# Altium schematic sheet Connectors.SchDoc
size 420 x 297 mm; SheetNumber: 3; SheetTotal: 5
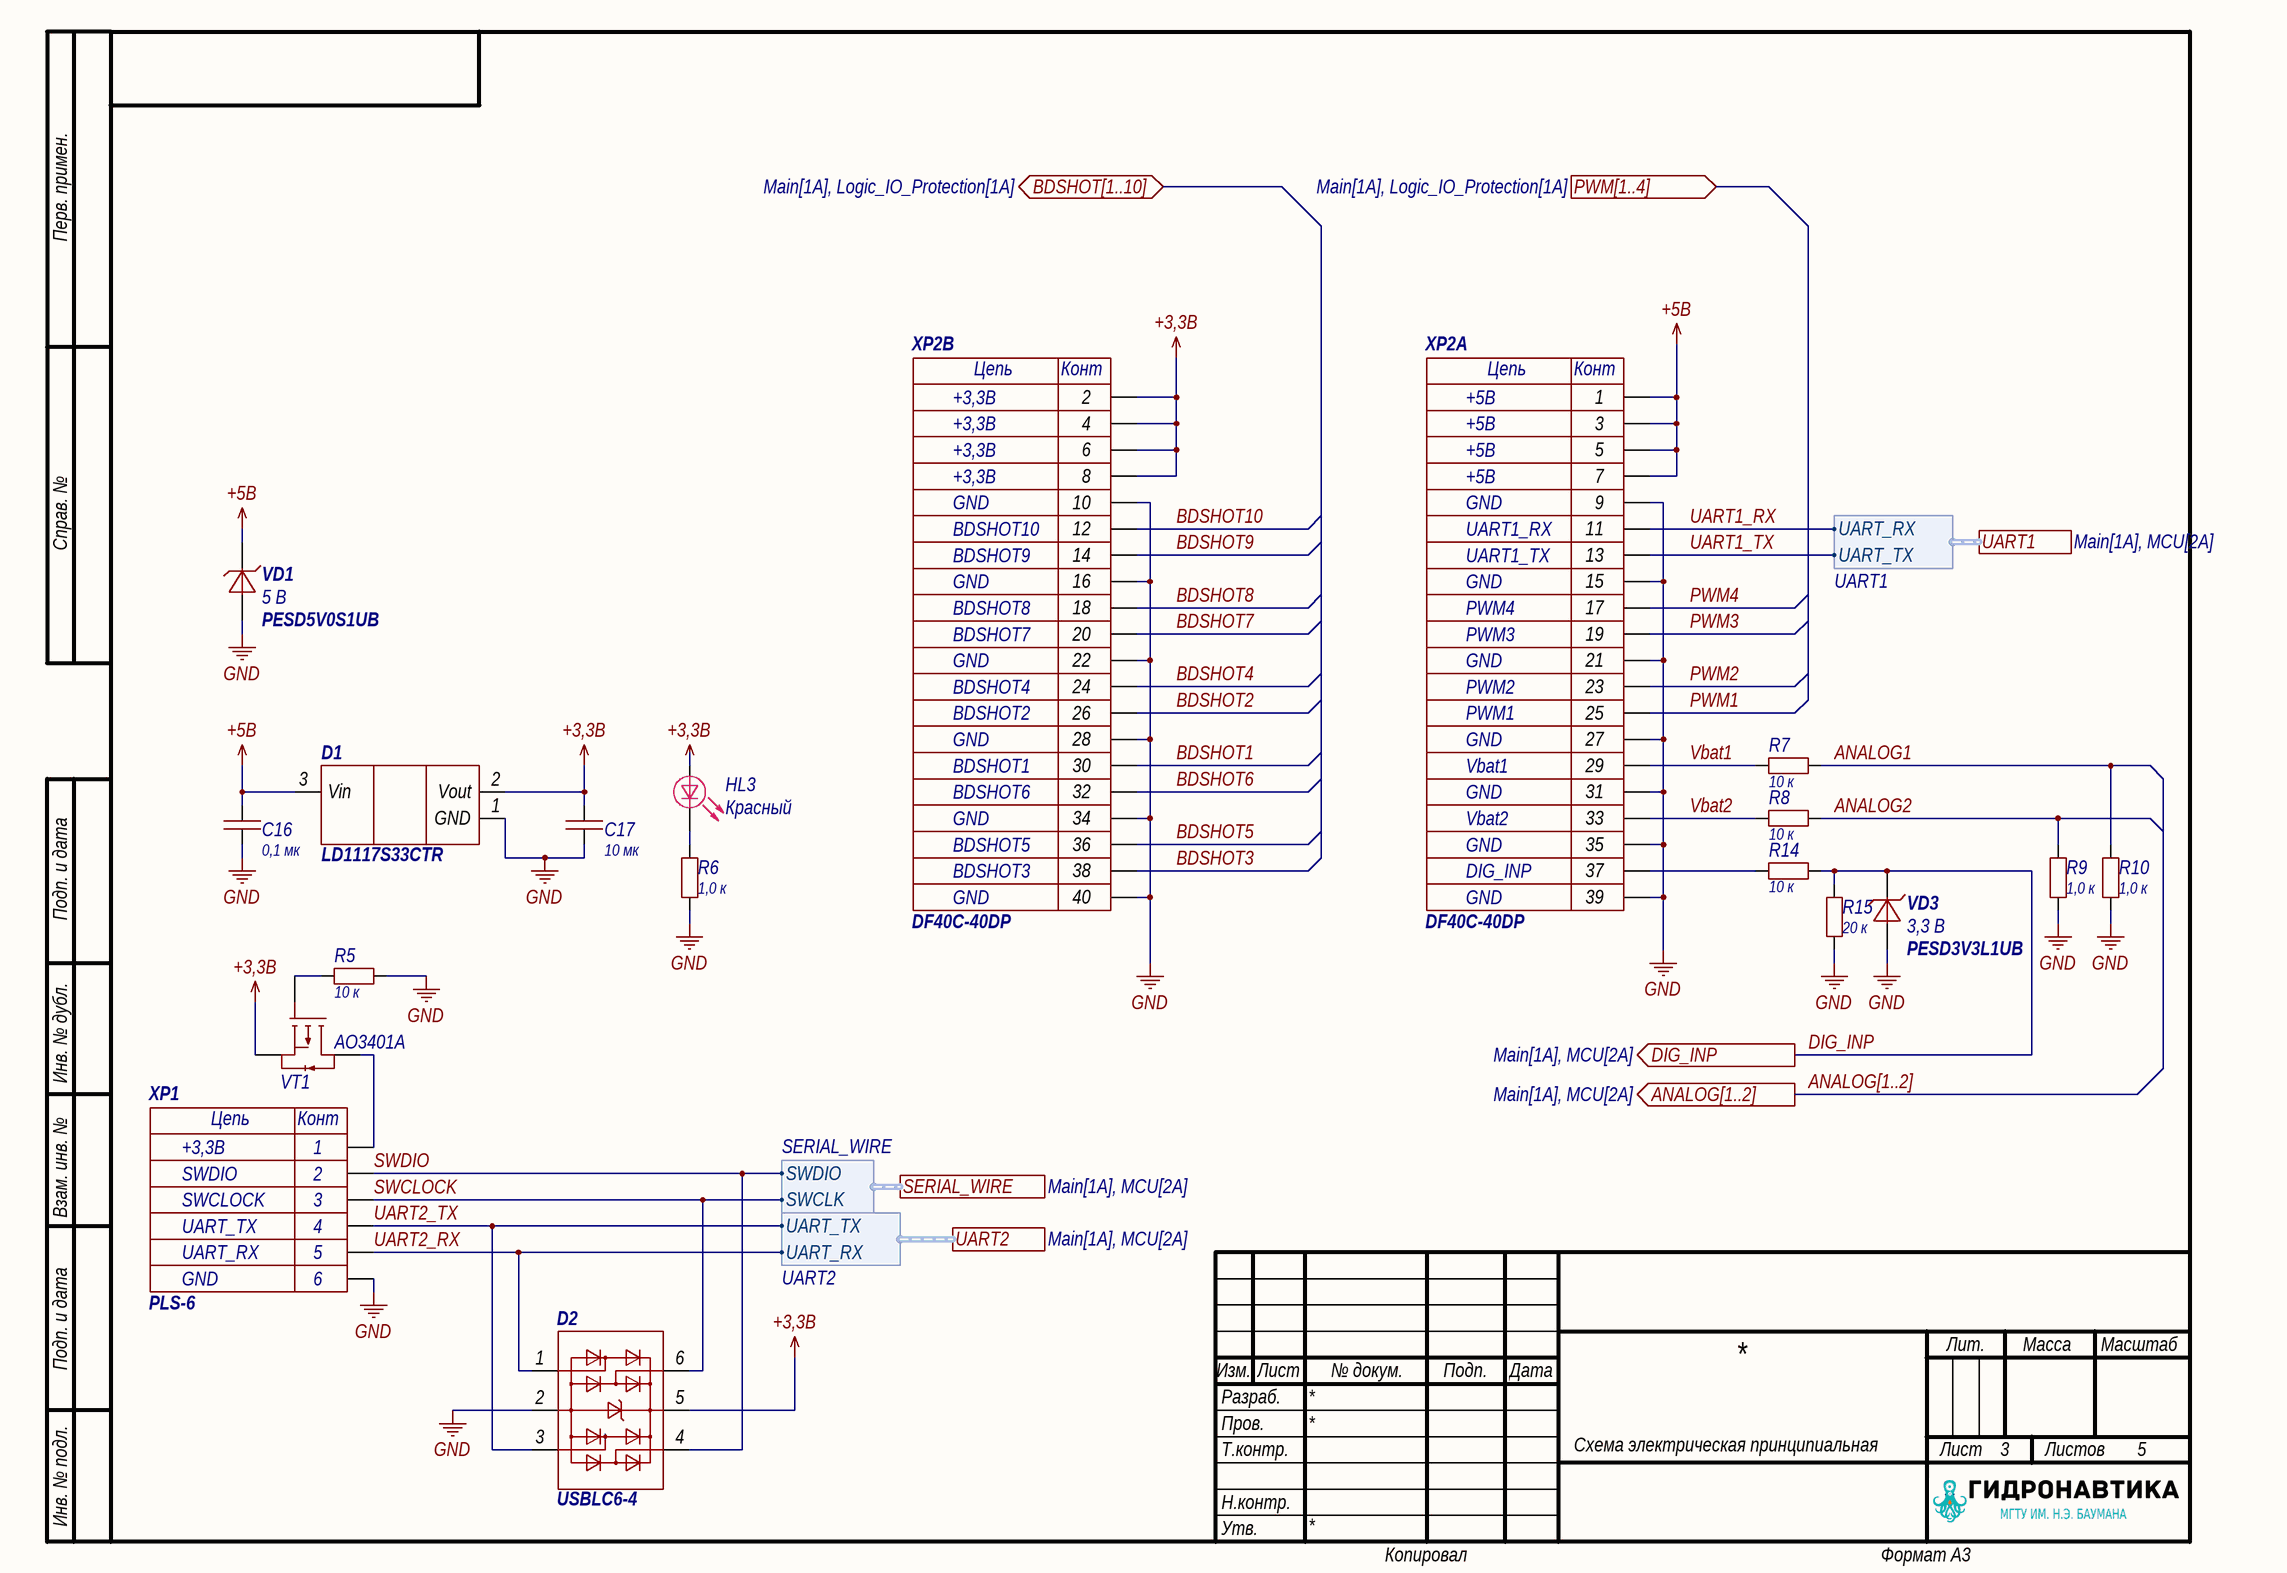
[diagram p0: Connectors.SchDoc]

## Parts
C16  value 0,1 мк  [0603C]  (hidden comment: Capacitor)
C17  value 10 мк  [1210C]  (hidden comment: Capacitor)
D1  LD1117S33CTR  [SOT223]
D2  USBLC6-4  [SOT23-6]
HL3  Color: Красный  [0805D]  (hidden comment: LED)
R5  value 10 к  [0603R]  (hidden comment: Resistor)
R6  value 1,0 к  [0603R]  (hidden comment: Resistor)
R7  value 10 к  [0603R]  (hidden comment: Resistor)
R8  value 10 к  [0603R]  (hidden comment: Resistor)
R9  value 1,0 к  [0603R]  (hidden comment: Resistor)
R10  value 1,0 к  [0603R]  (hidden comment: Resistor)
R14  value 10 к  [0603R]  (hidden comment: Resistor)
R15  value 20 к  [0603R]  (hidden comment: Resistor)
VD1  PESD5V0S1UB  value 5 В  [SOD523]
VD3  PESD3V3L1UB  value 3,3 В  [SOD523]
VT1  AO3401A  [SOT23-3]
XP1  PLS-6  Value1: +3,3В  Value2: SWDIO  Value3: SWCLOCK  Value4: UART_TX  Value5: UART_RX  Value6: GND  [PLS6]
XP2  DF40C-40DP  Value17: Vbat2  Value20: GND  Value19: DIG_INP  Value15: Vbat1  Value13: PWM1  Value12: PWM2  Value10: PWM3  Value9: PWM4  Value7: UART1_TX  Value6: UART1_RX  Value4: +5В  [DF40C-40DP]  (parts A,B of 2)

## Ports
ANALOG[1..2] (out, see Main[1A], MCU[2A]), BDSHOT[1..10] (bidir, see Main[1A], Logic_IO_Protection[1A]), DIG_INP (out, see Main[1A], MCU[2A]), PWM[1..4] (in, see Main[1A], Logic_IO_Protection[1A]), SERIAL_WIRE (harness SERIAL_WIRE, see Main[1A], MCU[2A]), UART1 (harness UART1, see Main[1A], MCU[2A]), UART2 (harness UART2, see Main[1A], MCU[2A])

## Harnesses
SERIAL_WIRE: SWDIO, SWCLK
UART2: UART_TX, UART_RX
UART1: UART_RX, UART_TX

## Nets
+3,3В: C17.2 D1.2(Vout) D2.5 HL3.1 VT1.2 XP2.2 XP2.4 XP2.6 XP2.8
+5В: C16.2 D1.3(Vin) VD1.2 XP2.1 XP2.3 XP2.5 XP2.7
GND: C16.1 C17.1 D1.1(GND) D2.2 R5.1 R6.1 R9.1 R10.1 R15.1 VD1.1 VD3.1 XP1.6 XP2.9 XP2.10 XP2.15 XP2.16 XP2.21 XP2.22 XP2.27 XP2.28 XP2.31 XP2.34 XP2.35 XP2.39 XP2.40
ANALOG1: R7.2 R10.2
ANALOG2: R8.2 R9.2
BDSHOT1: XP2.30
BDSHOT2: XP2.26
BDSHOT3: XP2.38
BDSHOT4: XP2.24
BDSHOT5: XP2.36
BDSHOT6: XP2.32
BDSHOT7: XP2.20
BDSHOT8: XP2.18
BDSHOT9: XP2.14
BDSHOT10: XP2.12
DIG_INP: R14.2 R15.2 VD3.2 ; port DIG_INP
PWM1: XP2.25
PWM2: XP2.23
PWM3: XP2.19
PWM4: XP2.17
SWCLOCK: D2.6 XP1.3 ; port SERIAL_WIRE.SWCLK
SWDIO: D2.4 XP1.2 ; port SERIAL_WIRE.SWDIO
UART1_RX: XP2.11 ; port UART1.UART_RX
UART1_TX: XP2.13 ; port UART1.UART_TX
UART2_RX: D2.1 XP1.5 ; port UART2.UART_RX
UART2_TX: D2.3 XP1.4 ; port UART2.UART_TX
Vbat1: R7.1 XP2.29
Vbat2: R8.1 XP2.33
NetHL3_2: HL3.2 R6.2
NetR5_2: R5.2 VT1.1
NetR14_1: R14.1 XP2.37
NetVT1_3: VT1.3 XP1.1

## Buses and harness runs
bus ANALOG[1..2] = port ANALOG[1..2]

## Notes on the sheet
- Перв. примен.
- Справ. №
- Подп. и дата
- Инв. № дубл.
- Взам. инв. №
- Разраб.
- Изм.
- Лист
- № докум.
- Подп.
- Дата
- Лит.
- Масса
- Масштаб
- Пров.
- Т.контр.
- Схема электрическая принципиальная
- Листов
- Инв. № подл.
- Утв.
- Н.контр.
- Копировал
- Формат А3
- (in symbol DF40C-40DP, part A) Цепь; Конт
- (in symbol DF40C-40DP, part B) Цепь; Конт
- (in symbol PLS-6) Цепь; Конт

## Library data of the parts
C16 = Capacitor_0,1u_10_50V_X7R_0603C: Конденсатор; Library Path2: Schematic\Capacitor.SchLib; Tolerance: 0,1; Voltage (V): 50; Dielectric: X7R; Capacity (nF): 100; Part Number: Capacitor_0,1u_10_50V_X7R_0603C
C17 = Capacitor_10u_10_35V_X7R_1210C: Конденсатор; Library Path2: Schematic\Capacitor.SchLib; Tolerance: 0,1; Voltage (V): 35; Dielectric: X7R; Capacity (nF): 10000; Part Number: Capacitor_10u_10_35V_X7R_1210C
D1 = LD1117S33CTR: Линейный стабилизатор напряжения; Part Number: LD1117S33CTR
D2 = USBLC6-4: Сборка защитных диодов для USB; ComponentLink1Description: Shop; ComponentLink1URL: https://www.chipdip.ru/product0/8001780508; Part Number: USBLC6-4
HL3 = LED: Светодиод; Part Number: LED
R5 R7 R8 = Resistor_10k_1_0603: Резистор номиналом 10 кОм и точностью 1%; Power: *; Part Number: Resistor_10k_1_0603; Tolerance: 1%
R6 R9 R10 = Resistor_1.0k_1_0603: Резистор номиналом 1,0 кОм и точностью 1%; Power: *; Part Number: Resistor_1.0k_1_0603; Tolerance: 1%
R14 = Resistor_10k_1_0603: Резистор номиналом 10 кОм 1%; Power: *; Part Number: Resistor_10k_1_0603; Tolerance: 1%
R15 = Resistor_20k_1_0603: Резистор номиналом 20 кОм 1%; Power: *; Part Number: Resistor_20k_1_0603; Tolerance: 1%
VD1 = PESD5V0S1UB: Защитный диод на 5 В, рассеиваемая мощность 330 Вт; Voltage nominal (V): 5; Power (W): 330; Part Number: PESD5V0S1UB
VD3 = PESD3V3L1UB: Защитный диод на 3,3 В, рассеиваемая мощность 45 Вт; Voltage nominal (V): 3,3; Power (W): 45; Автор: glebmih; Part Number: PESD3V3L1UB
VT1 = AO3401A: P-канальный MOSFET; Part Number: AO3401A
XP1 = PLS-6: Гребенка 6 пинов; System: Connector; Part Number: PLS-6
XP2 = DF40C-40DP: Разъем плата-плата 40 пинов, мама, шаг 0.4мм; System: Connector; Value18: GND; Value16: GND; Value14: GND; Value11: GND; Value8: GND; Value5: GND; Value3: +5В; Value2: +5В; Value1: +5В; Part Number: DF40C-40DP